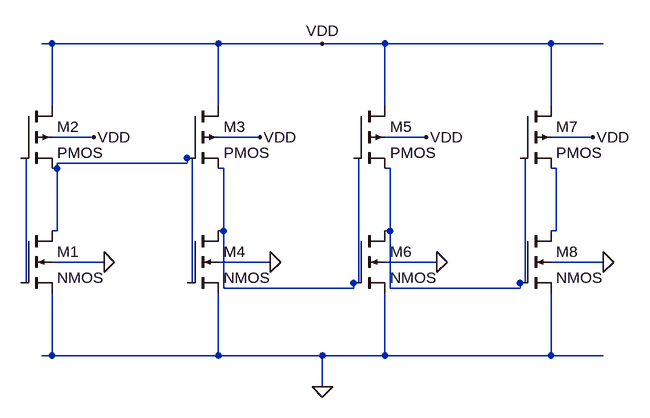
[diagram p0: schematic buffer.asc]
buffer.asc, the LTspice schematic file:
Version 4
SHEET 1 1200 1200
WIRE 176 288 160 288
WIRE 432 288 176 288
WIRE 592 288 432 288
WIRE 688 288 592 288
WIRE 944 288 688 288
WIRE 1024 288 944 288
WIRE 176 384 176 288
WIRE 432 384 432 288
WIRE 688 384 688 288
WIRE 944 384 944 288
WIRE 240 432 176 432
WIRE 496 432 432 432
WIRE 752 432 688 432
WIRE 1008 432 944 432
WIRE 136 464 128 464
WIRE 392 464 384 464
WIRE 648 464 640 464
WIRE 904 464 896 464
WIRE 384 472 384 464
WIRE 384 472 184 472
WIRE 184 480 184 472
WIRE 184 480 176 480
WIRE 440 480 432 480
WIRE 696 480 688 480
WIRE 952 480 944 480
WIRE 184 576 184 480
WIRE 184 576 176 576
WIRE 440 576 440 480
WIRE 440 576 432 576
WIRE 696 576 696 480
WIRE 696 576 688 576
WIRE 952 576 952 480
WIRE 952 576 944 576
WIRE 256 624 176 624
WIRE 512 624 432 624
WIRE 768 624 688 624
WIRE 1024 624 944 624
WIRE 136 656 136 464
WIRE 136 656 128 656
WIRE 392 656 392 464
WIRE 392 656 384 656
WIRE 648 656 648 464
WIRE 648 656 640 656
WIRE 904 656 904 464
WIRE 904 656 896 656
WIRE 440 664 440 576
WIRE 640 664 640 656
WIRE 640 664 440 664
WIRE 696 664 696 576
WIRE 896 664 896 656
WIRE 896 664 696 664
WIRE 176 768 176 672
WIRE 176 768 160 768
WIRE 432 768 432 672
WIRE 432 768 176 768
WIRE 592 768 432 768
WIRE 688 768 688 672
WIRE 688 768 592 768
WIRE 944 768 944 672
WIRE 944 768 688 768
WIRE 1024 768 944 768
WIRE 592 816 592 768
FLAG 592 816 0
FLAG 256 624 0
FLAG 512 624 0
FLAG 768 624 0
FLAG 1024 624 0
FLAG 592 288 VDD
FLAG 240 432 VDD
FLAG 496 432 VDD
FLAG 752 432 VDD
FLAG 1008 432 VDD
SYMBOL pmos4 128 384 R0
SYMATTR InstName M2
SYMATTR Value2 l=180n w=2.5u
SYMBOL pmos4 384 384 R0
SYMATTR InstName M3
SYMATTR Value2 l=180n w=2.5u
SYMBOL pmos4 640 384 R0
SYMATTR InstName M5
SYMATTR Value2 l=180n w=2.5u
SYMBOL pmos4 896 384 R0
SYMATTR InstName M7
SYMATTR Value2 l=180n w=2.5u
SYMBOL nmos4 128 576 R0
SYMATTR InstName M1
SYMATTR Value2 l=180n w=1u
SYMBOL nmos4 384 576 R0
SYMATTR InstName M4
SYMATTR Value2 l=180n w=1u
SYMBOL nmos4 640 576 R0
SYMATTR InstName M6
SYMATTR Value2 l=180n w=1u
SYMBOL nmos4 896 576 R0
SYMATTR InstName M8
SYMATTR Value2 l=180n w=1u

The netlist it stands for:
* buffer.asc
M2 VDD N001 N002 VDD PMOS l=180n w=2.5u
M3 VDD N002 N003 VDD PMOS l=180n w=2.5u
M5 VDD N003 N004 VDD PMOS l=180n w=2.5u
M7 VDD N004 N005 VDD PMOS l=180n w=2.5u
M1 N002 N001 0 0 NMOS l=180n w=1u
M4 N003 N002 0 0 NMOS l=180n w=1u
M6 N004 N003 0 0 NMOS l=180n w=1u
M8 N005 N004 0 0 NMOS l=180n w=1u
.model NMOS NMOS
.model PMOS PMOS
.lib standard.mos
.backanno
.end